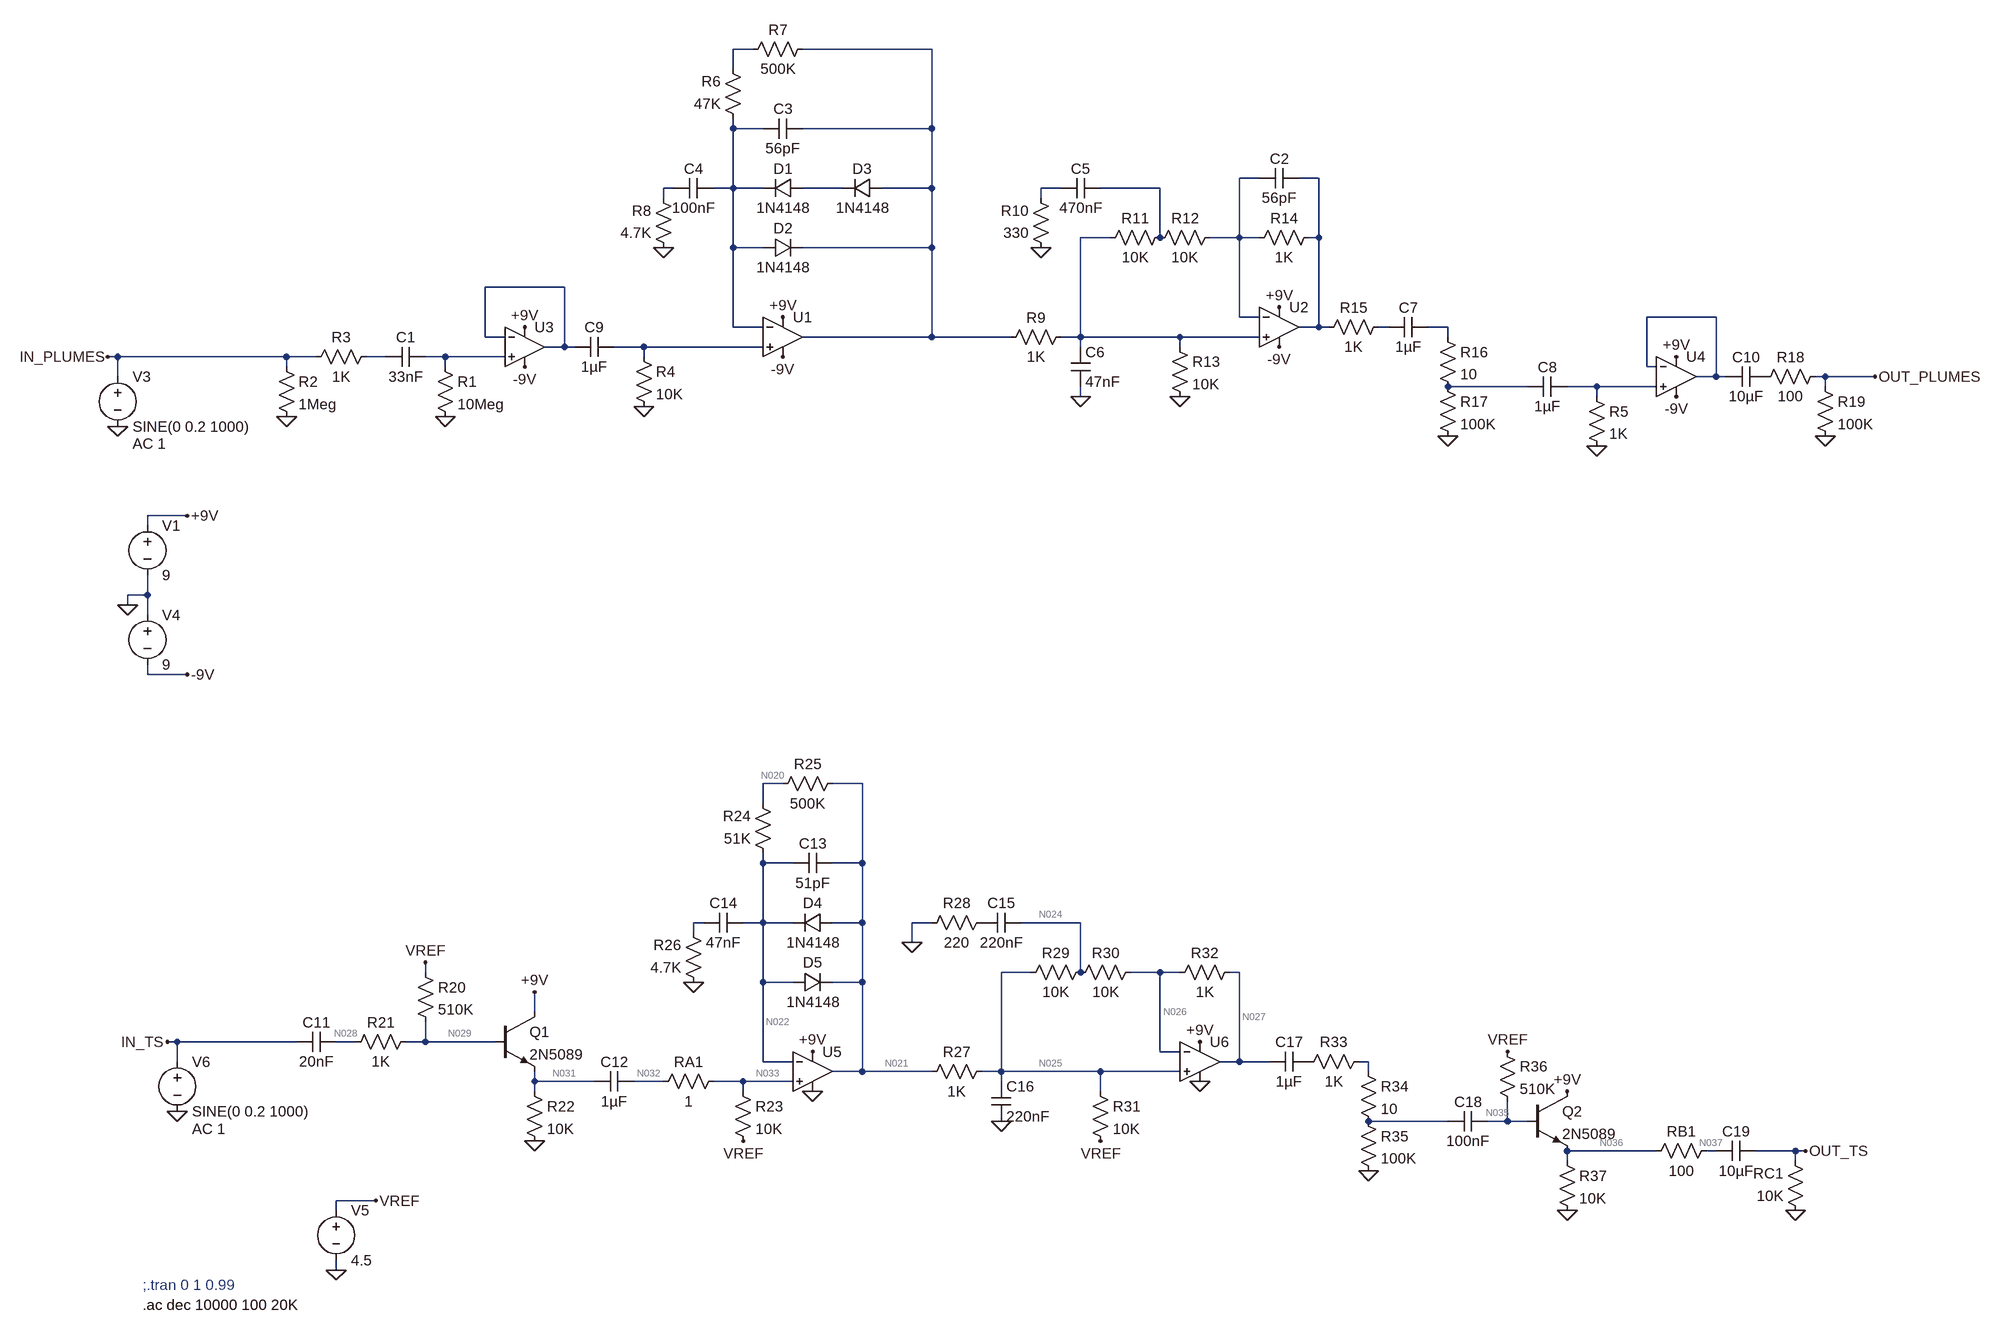
[diagram p0: schematic plumes_TS_sim.asc]
plumes_TS_sim.asc, the LTspice schematic file:
Version 4
SHEET 1 2708 1688
WIRE 608 -352 576 -352
WIRE 896 -352 688 -352
WIRE 576 -320 576 -352
WIRE 576 -224 576 -240
WIRE 624 -224 576 -224
WIRE 896 -224 896 -352
WIRE 896 -224 688 -224
WIRE 1424 -144 1392 -144
WIRE 1520 -144 1488 -144
WIRE 480 -128 464 -128
WIRE 576 -128 576 -224
WIRE 576 -128 544 -128
WIRE 624 -128 576 -128
WIRE 752 -128 688 -128
WIRE 896 -128 896 -224
WIRE 896 -128 816 -128
WIRE 1104 -128 1072 -128
WIRE 1264 -128 1168 -128
WIRE 464 -112 464 -128
WIRE 1072 -112 1072 -128
WIRE 1184 -48 1136 -48
WIRE 1264 -48 1264 -128
WIRE 1392 -48 1392 -144
WIRE 1392 -48 1344 -48
WIRE 1424 -48 1392 -48
WIRE 1520 -48 1520 -144
WIRE 1520 -48 1504 -48
WIRE 576 -32 576 -128
WIRE 624 -32 576 -32
WIRE 896 -32 896 -128
WIRE 896 -32 688 -32
WIRE 304 32 176 32
WIRE 1392 80 1392 -48
WIRE 1424 80 1392 80
WIRE 2160 80 2048 80
WIRE 576 96 576 -32
WIRE 624 96 576 96
WIRE 1520 96 1520 -48
WIRE 1520 96 1488 96
WIRE 1536 96 1520 96
WIRE 1632 96 1616 96
WIRE 1728 96 1696 96
WIRE 176 112 176 32
WIRE 208 112 176 112
WIRE 896 112 896 -32
WIRE 896 112 688 112
WIRE 1024 112 896 112
WIRE 1136 112 1136 -48
WIRE 1136 112 1104 112
WIRE 1296 112 1136 112
WIRE 1424 112 1296 112
WIRE 1728 112 1728 96
WIRE 304 128 304 32
WIRE 304 128 272 128
WIRE 320 128 304 128
WIRE 432 128 384 128
WIRE 624 128 432 128
WIRE 1136 128 1136 112
WIRE 1296 128 1296 112
WIRE -416 144 -432 144
WIRE -144 144 -416 144
WIRE -96 144 -144 144
WIRE 16 144 -16 144
WIRE 112 144 80 144
WIRE 208 144 112 144
WIRE 432 144 432 128
WIRE -144 160 -144 144
WIRE 112 160 112 144
WIRE 2048 160 2048 80
WIRE 2064 160 2048 160
WIRE -416 176 -416 144
WIRE 2160 176 2160 80
WIRE 2160 176 2128 176
WIRE 2176 176 2160 176
WIRE 2336 176 2320 176
WIRE 2416 176 2336 176
WIRE 1856 192 1728 192
WIRE 1968 192 1920 192
WIRE 2064 192 1968 192
WIRE 2336 192 2336 176
WIRE 1136 208 1136 192
WIRE 1968 208 1968 192
WIRE -304 400 -368 400
WIRE -368 416 -368 400
WIRE -368 528 -368 496
WIRE -368 528 -400 528
WIRE -400 544 -400 528
WIRE -368 560 -368 528
WIRE -368 656 -368 640
WIRE -304 656 -368 656
WIRE 656 832 624 832
WIRE 784 832 736 832
WIRE 624 864 624 832
WIRE 624 960 624 944
WIRE 672 960 624 960
WIRE 784 960 784 832
WIRE 784 960 736 960
WIRE 528 1056 512 1056
WIRE 624 1056 624 960
WIRE 624 1056 592 1056
WIRE 672 1056 624 1056
WIRE 784 1056 784 960
WIRE 784 1056 736 1056
WIRE 896 1056 864 1056
WIRE 1136 1056 1040 1056
WIRE 512 1072 512 1056
WIRE 864 1088 864 1056
WIRE 80 1136 80 1120
WIRE 1056 1136 1008 1136
WIRE 1136 1136 1136 1056
WIRE 1264 1136 1216 1136
WIRE 1296 1136 1264 1136
WIRE 1392 1136 1376 1136
WIRE 624 1152 624 1056
WIRE 672 1152 624 1152
WIRE 784 1152 784 1056
WIRE 784 1152 736 1152
WIRE 256 1200 256 1168
WIRE -320 1248 -336 1248
WIRE -128 1248 -320 1248
WIRE -32 1248 -64 1248
WIRE 80 1248 80 1216
WIRE 80 1248 48 1248
WIRE 192 1248 80 1248
WIRE 1264 1264 1264 1136
WIRE 1296 1264 1264 1264
WIRE -320 1280 -320 1248
WIRE 624 1280 624 1152
WIRE 672 1280 624 1280
WIRE 1392 1280 1392 1136
WIRE 1392 1280 1360 1280
WIRE 1440 1280 1392 1280
WIRE 1600 1280 1584 1280
WIRE 784 1296 784 1152
WIRE 784 1296 736 1296
WIRE 896 1296 784 1296
WIRE 1008 1296 1008 1136
WIRE 1008 1296 976 1296
WIRE 1168 1296 1008 1296
WIRE 1296 1296 1168 1296
WIRE 1600 1296 1600 1280
WIRE 256 1312 256 1296
WIRE 352 1312 256 1312
WIRE 464 1312 416 1312
WIRE 592 1312 544 1312
WIRE 672 1312 592 1312
WIRE 1008 1312 1008 1296
WIRE 256 1328 256 1312
WIRE 592 1328 592 1312
WIRE 1168 1328 1168 1296
WIRE 1728 1376 1600 1376
WIRE 1824 1376 1824 1344
WIRE 1824 1376 1792 1376
WIRE 1856 1376 1824 1376
WIRE 2064 1424 1920 1424
WIRE 2160 1424 2144 1424
WIRE 2288 1424 2224 1424
WIRE 2304 1424 2288 1424
WIRE 1920 1440 1920 1424
WIRE 2288 1440 2288 1424
WIRE 0 1504 -64 1504
WIRE -64 1520 -64 1504
WIRE -64 1616 -64 1600
FLAG -304 400 +9V
FLAG -416 256 0
FLAG -432 144 IN_PLUMES
FLAG 464 -32 0
FLAG 656 80 +9V
FLAG 1136 208 0
FLAG 1456 64 +9V
FLAG 1728 272 0
FLAG -144 240 0
FLAG 112 240 0
FLAG 240 96 +9V
FLAG -400 544 0
FLAG -304 656 -9V
FLAG 240 160 -9V
FLAG 432 224 0
FLAG 1296 208 0
FLAG 1968 288 0
FLAG 656 144 -9V
FLAG 1456 128 -9V
FLAG 2096 208 -9V
FLAG 2096 144 +9V
FLAG 2336 272 0
FLAG 2416 176 OUT_PLUMES
FLAG 1072 -32 0
FLAG 256 1408 0
FLAG -64 1616 0
FLAG 0 1504 VREF
FLAG 256 1168 +9V
FLAG 80 1120 VREF
FLAG 592 1408 VREF
FLAG -320 1360 0
FLAG -336 1248 IN_TS
FLAG 512 1152 0
FLAG 704 1264 +9V
FLAG 704 1328 0
FLAG 864 1088 0
FLAG 1008 1376 0
FLAG 1168 1408 VREF
FLAG 1328 1248 +9V
FLAG 1328 1312 0
FLAG 1600 1456 0
FLAG 1824 1264 VREF
FLAG 1920 1520 0
FLAG 1920 1328 +9V
FLAG 2288 1520 0
FLAG 2304 1424 OUT_TS
SYMBOL voltage -368 400 R0
WINDOW 123 0 0 Left 0
WINDOW 39 0 0 Left 0
SYMATTR InstName V1
SYMATTR Value 9
SYMBOL voltage -416 160 R0
WINDOW 123 24 124 Left 2
WINDOW 39 0 0 Left 0
SYMATTR Value2 AC 1
SYMATTR InstName V3
SYMATTR Value SINE(0 0.2 1000)
SYMBOL diode 688 -144 R90
WINDOW 0 0 32 VBottom 2
WINDOW 3 32 32 VTop 2
SYMATTR InstName D1
SYMATTR Value 1N4148
SYMBOL diode 624 -16 R270
WINDOW 0 32 32 VTop 2
WINDOW 3 0 32 VBottom 2
SYMATTR InstName D2
SYMATTR Value 1N4148
SYMBOL cap 688 -240 R90
WINDOW 0 0 32 VBottom 2
WINDOW 3 32 32 VTop 2
SYMATTR InstName C3
SYMATTR Value 56pF
SYMBOL res 592 -224 R180
WINDOW 0 36 76 Left 2
WINDOW 3 36 40 Left 2
SYMATTR InstName R6
SYMATTR Value 47K
SYMBOL res 704 -368 R90
WINDOW 0 0 56 VBottom 2
WINDOW 3 32 56 VTop 2
SYMATTR InstName R7
SYMATTR Value 500K
SYMBOL cap 544 -144 R90
WINDOW 0 0 32 VBottom 2
WINDOW 3 32 32 VTop 2
SYMATTR InstName C4
SYMATTR Value 100nF
SYMBOL res 480 -16 R180
WINDOW 0 36 76 Left 2
WINDOW 3 36 40 Left 2
SYMATTR InstName R8
SYMATTR Value 4.7K
SYMBOL res 1120 96 R90
WINDOW 0 0 56 VBottom 2
WINDOW 3 32 56 VTop 2
SYMATTR InstName R9
SYMATTR Value 1K
SYMBOL cap 1168 -144 R90
WINDOW 0 0 32 VBottom 2
WINDOW 3 32 32 VTop 2
SYMATTR InstName C5
SYMATTR Value 470nF
SYMBOL res 1280 -64 R90
WINDOW 0 0 56 VBottom 2
WINDOW 3 32 56 VTop 2
SYMATTR InstName R11
SYMATTR Value 10K
SYMBOL res 1360 -64 R90
WINDOW 0 0 56 VBottom 2
WINDOW 3 32 56 VTop 2
SYMATTR InstName R12
SYMATTR Value 10K
SYMBOL cap 1120 128 R0
SYMATTR InstName C6
SYMATTR Value 47nF
SYMBOL res 1280 112 R0
SYMATTR InstName R13
SYMATTR Value 10K
SYMBOL res 1520 -64 R90
WINDOW 0 0 56 VBottom 2
WINDOW 3 32 56 VTop 2
SYMATTR InstName R14
SYMATTR Value 1K
SYMBOL res 1632 80 R90
WINDOW 0 0 56 VBottom 2
WINDOW 3 32 56 VTop 2
SYMATTR InstName R15
SYMATTR Value 1K
SYMBOL res 1712 96 R0
SYMATTR InstName R16
SYMATTR Value 10
SYMBOL res 1712 176 R0
SYMATTR InstName R17
SYMATTR Value 100K
SYMBOL cap 1920 176 R90
WINDOW 0 0 32 VBottom 2
WINDOW 3 32 32 VTop 2
SYMATTR InstName C8
SYMATTR Value 1µF
SYMBOL UniversalOpAmp2 656 112 R0
SYMATTR InstName U1
SYMBOL UniversalOpAmp2 1456 96 R0
SYMATTR InstName U2
SYMBOL UniversalOpAmp2 240 128 R0
SYMATTR InstName U3
SYMBOL res 96 144 R0
SYMATTR InstName R1
SYMATTR Value 10Meg
SYMBOL res -160 144 R0
SYMATTR InstName R2
SYMATTR Value 1Meg
SYMBOL res 0 128 R90
WINDOW 0 0 56 VBottom 2
WINDOW 3 32 56 VTop 2
SYMATTR InstName R3
SYMATTR Value 1K
SYMBOL cap 80 128 R90
WINDOW 0 0 32 VBottom 2
WINDOW 3 32 32 VTop 2
SYMATTR InstName C1
SYMATTR Value 33nF
SYMBOL voltage -368 544 R0
WINDOW 123 0 0 Left 0
WINDOW 39 0 0 Left 0
SYMATTR InstName V4
SYMATTR Value 9
SYMBOL cap 384 112 R90
WINDOW 0 0 32 VBottom 2
WINDOW 3 32 32 VTop 2
SYMATTR InstName C9
SYMATTR Value 1µF
SYMBOL res 416 128 R0
SYMATTR InstName R4
SYMATTR Value 10K
SYMBOL cap 1488 -160 R90
WINDOW 0 0 32 VBottom 2
WINDOW 3 32 32 VTop 2
SYMATTR InstName C2
SYMATTR Value 56pF
SYMBOL cap 1696 80 R90
WINDOW 0 0 32 VBottom 2
WINDOW 3 32 32 VTop 2
SYMATTR InstName C7
SYMATTR Value 1µF
SYMBOL res 1952 192 R0
SYMATTR InstName R5
SYMATTR Value 1K
SYMBOL UniversalOpAmp2 2096 176 R0
SYMATTR InstName U4
SYMBOL cap 2240 160 R90
WINDOW 0 0 32 VBottom 2
WINDOW 3 32 32 VTop 2
SYMATTR InstName C10
SYMATTR Value 10µF
SYMBOL res 2336 160 R90
WINDOW 0 0 56 VBottom 2
WINDOW 3 32 56 VTop 2
SYMATTR InstName R18
SYMATTR Value 100
SYMBOL res 2320 176 R0
SYMATTR InstName R19
SYMATTR Value 100K
SYMBOL diode 816 -144 R90
WINDOW 0 0 32 VBottom 2
WINDOW 3 32 32 VTop 2
SYMATTR InstName D3
SYMATTR Value 1N4148
SYMBOL res 1088 -16 R180
WINDOW 0 36 76 Left 2
WINDOW 3 36 40 Left 2
SYMATTR InstName R10
SYMATTR Value 330
SYMBOL npn 192 1200 R0
SYMATTR InstName Q1
SYMATTR Value 2N5089
SYMBOL res 64 1120 R0
SYMATTR InstName R20
SYMATTR Value 510K
SYMBOL res 64 1232 R90
WINDOW 0 0 56 VBottom 2
WINDOW 3 32 56 VTop 2
SYMATTR InstName R21
SYMATTR Value 1K
SYMBOL res 240 1312 R0
SYMATTR InstName R22
SYMATTR Value 10K
SYMBOL res 560 1296 R90
WINDOW 0 0 56 VBottom 2
WINDOW 3 32 56 VTop 2
SYMATTR InstName RA1
SYMATTR Value 1
SYMBOL res 576 1312 R0
SYMATTR InstName R23
SYMATTR Value 10K
SYMBOL cap -64 1232 R90
WINDOW 0 0 32 VBottom 2
WINDOW 3 32 32 VTop 2
SYMATTR InstName C11
SYMATTR Value 20nF
SYMBOL cap 416 1296 R90
WINDOW 0 0 32 VBottom 2
WINDOW 3 32 32 VTop 2
SYMATTR InstName C12
SYMATTR Value 1µF
SYMBOL voltage -64 1504 R0
WINDOW 123 0 0 Left 0
WINDOW 39 0 0 Left 0
SYMATTR InstName V5
SYMATTR Value 4.5
SYMBOL voltage -320 1264 R0
WINDOW 123 24 124 Left 2
WINDOW 39 0 0 Left 0
SYMATTR Value2 AC 1
SYMATTR InstName V6
SYMATTR Value SINE(0 0.2 1000)
SYMBOL diode 736 1040 R90
WINDOW 0 0 32 VBottom 2
WINDOW 3 32 32 VTop 2
SYMATTR InstName D4
SYMATTR Value 1N4148
SYMBOL diode 672 1168 R270
WINDOW 0 32 32 VTop 2
WINDOW 3 0 32 VBottom 2
SYMATTR InstName D5
SYMATTR Value 1N4148
SYMBOL cap 736 944 R90
WINDOW 0 0 32 VBottom 2
WINDOW 3 32 32 VTop 2
SYMATTR InstName C13
SYMATTR Value 51pF
SYMBOL res 640 960 R180
WINDOW 0 36 76 Left 2
WINDOW 3 36 40 Left 2
SYMATTR InstName R24
SYMATTR Value 51K
SYMBOL res 752 816 R90
WINDOW 0 0 56 VBottom 2
WINDOW 3 32 56 VTop 2
SYMATTR InstName R25
SYMATTR Value 500K
SYMBOL cap 592 1040 R90
WINDOW 0 0 32 VBottom 2
WINDOW 3 32 32 VTop 2
SYMATTR InstName C14
SYMATTR Value 47nF
SYMBOL res 528 1168 R180
WINDOW 0 36 76 Left 2
WINDOW 3 36 40 Left 2
SYMATTR InstName R26
SYMATTR Value 4.7K
SYMBOL res 992 1280 R90
WINDOW 0 0 56 VBottom 2
WINDOW 3 32 56 VTop 2
SYMATTR InstName R27
SYMATTR Value 1K
SYMBOL res 992 1040 R90
WINDOW 0 0 56 VBottom 2
WINDOW 3 32 56 VTop 2
SYMATTR InstName R28
SYMATTR Value 220
SYMBOL cap 1040 1040 R90
WINDOW 0 0 32 VBottom 2
WINDOW 3 32 32 VTop 2
SYMATTR InstName C15
SYMATTR Value 220nF
SYMBOL res 1152 1120 R90
WINDOW 0 0 56 VBottom 2
WINDOW 3 32 56 VTop 2
SYMATTR InstName R29
SYMATTR Value 10K
SYMBOL res 1232 1120 R90
WINDOW 0 0 56 VBottom 2
WINDOW 3 32 56 VTop 2
SYMATTR InstName R30
SYMATTR Value 10K
SYMBOL cap 992 1312 R0
SYMATTR InstName C16
SYMATTR Value 220nF
SYMBOL res 1152 1312 R0
SYMATTR InstName R31
SYMATTR Value 10K
SYMBOL res 1392 1120 R90
WINDOW 0 0 56 VBottom 2
WINDOW 3 32 56 VTop 2
SYMATTR InstName R32
SYMATTR Value 1K
SYMBOL cap 1504 1264 R90
WINDOW 0 0 32 VBottom 2
WINDOW 3 32 32 VTop 2
SYMATTR InstName C17
SYMATTR Value 1µF
SYMBOL res 1600 1264 R90
WINDOW 0 0 56 VBottom 2
WINDOW 3 32 56 VTop 2
SYMATTR InstName R33
SYMATTR Value 1K
SYMBOL res 1584 1280 R0
SYMATTR InstName R34
SYMATTR Value 10
SYMBOL res 1584 1360 R0
SYMATTR InstName R35
SYMATTR Value 100K
SYMBOL cap 1792 1360 R90
WINDOW 0 0 32 VBottom 2
WINDOW 3 32 32 VTop 2
SYMATTR InstName C18
SYMATTR Value 100nF
SYMBOL res 1808 1248 R0
SYMATTR InstName R36
SYMATTR Value 510K
SYMBOL res 1904 1424 R0
SYMATTR InstName R37
SYMATTR Value 10K
SYMBOL npn 1856 1328 R0
SYMATTR InstName Q2
SYMATTR Value 2N5089
SYMBOL res 2160 1408 R90
WINDOW 0 0 56 VBottom 2
WINDOW 3 32 56 VTop 2
SYMATTR InstName RB1
SYMATTR Value 100
SYMBOL res 2304 1536 R180
WINDOW 0 36 76 Left 2
WINDOW 3 36 40 Left 2
SYMATTR InstName RC1
SYMATTR Value 10K
SYMBOL cap 2224 1408 R90
WINDOW 0 0 32 VBottom 2
WINDOW 3 32 32 VTop 2
SYMATTR InstName C19
SYMATTR Value 10µF
SYMBOL UniversalOpAmp2 704 1296 R0
SYMATTR InstName U5
SYMBOL UniversalOpAmp2 1328 1280 R0
SYMATTR InstName U6
TEXT -376 1640 Left 2 ;;.tran 0 1 0.99
TEXT -376 1672 Left 2 !.ac dec 10000 100 20K

The netlist it stands for:
* plumes_TS_sim.asc
V1 +9V 0 9
V3 IN_PLUMES 0 SINE(0 0.2 1000) AC 1
D1 N007 N003 1N4148
D2 N003 N002 1N4148
C3 N002 N003 56pF
R6 N003 N001 47K
R7 N002 N001 500K
C4 N003 N006 100nF
R8 0 N006 4.7K
R9 N010 N002 1K
C5 N009 N008 470nF
R11 N009 N010 10K
R12 N004 N009 10K
C6 N010 0 47nF
R13 N010 0 10K
R14 N005 N004 1K
R15 N013 N005 1K
R16 N014 N018 10
R17 N018 0 100K
C8 N019 N018 1µF
XU1 N015 N003 +9V -9V N002 level2 Avol=1Meg GBW=10Meg Slew=10Meg Ilimit=25m Rail=0 Vos=0 En=0 Enk=0 In=0 Ink=0 Rin=500Meg  ; pins In+ In- V+ V- OUT
XU2 N010 N004 +9V -9V N005 level2 Avol=1Meg GBW=10Meg Slew=10Meg Ilimit=25m Rail=0 Vos=0 En=0 Enk=0 In=0 Ink=0 Rin=500Meg  ; pins In+ In- V+ V- OUT
XU3 N017 N011 +9V -9V N011 level2 Avol=1Meg GBW=10Meg Slew=10Meg Ilimit=25m Rail=0 Vos=0 En=0 Enk=0 In=0 Ink=0 Rin=500Meg  ; pins In+ In- V+ V- OUT
R1 N017 0 10Meg
R2 IN_PLUMES 0 1Meg
R3 N016 IN_PLUMES 1K
C1 N017 N016 33nF
V4 0 -9V 9
C9 N015 N011 1µF
R4 N015 0 10K
C2 N005 N004 56pF
C7 N014 N013 1µF
R5 N019 0 1K
XU4 N019 N012 +9V -9V N012 level2 Avol=1Meg GBW=10Meg Slew=10Meg Ilimit=25m Rail=0 Vos=0 En=0 Enk=0 In=0 Ink=0 Rin=500Meg  ; pins In+ In- V+ V- OUT
C10 P001 N012 10µF
R18 OUT_PLUMES P001 100
R19 OUT_PLUMES 0 100K
D3 N002 N007 1N4148
R10 0 N008 330
Q1 +9V N029 N031 0 2N5089
R20 VREF N029 510K
R21 N029 N028 1K
R22 N031 0 10K
RA1 N033 N032 1
R23 N033 VREF 10K
C11 N028 IN_TS 20nF
C12 N032 N031 1µF
V5 VREF 0 4.5
V6 IN_TS 0 SINE(0 0.2 1000) AC 1
D4 N021 N022 1N4148
D5 N022 N021 1N4148
C13 N021 N022 51pF
R24 N022 N020 51K
R25 N021 N020 500K
C14 N022 N023 47nF
R26 0 N023 4.7K
R27 N025 N021 1K
R28 P002 0 220
C15 N024 P002 220nF
R29 N024 N025 10K
R30 N026 N024 10K
C16 N025 0 220nF
R31 N025 VREF 10K
R32 N027 N026 1K
C17 P003 N027 1µF
R33 N030 P003 1K
R34 N030 N034 10
R35 N034 0 100K
C18 N035 N034 100nF
R36 VREF N035 510K
R37 N036 0 10K
Q2 +9V N035 N036 0 2N5089
RB1 N037 N036 100
RC1 0 OUT_TS 10K
C19 OUT_TS N037 10µF
XU5 N033 N022 +9V 0 N021 level2 Avol=1Meg GBW=10Meg Slew=10Meg Ilimit=25m Rail=0 Vos=0 En=0 Enk=0 In=0 Ink=0 Rin=500Meg  ; pins In+ In- V+ V- OUT
XU6 N025 N026 +9V 0 N027 level2 Avol=1Meg GBW=10Meg Slew=10Meg Ilimit=25m Rail=0 Vos=0 En=0 Enk=0 In=0 Ink=0 Rin=500Meg  ; pins In+ In- V+ V- OUT
.model D D
.lib standard.dio
.model NPN NPN
.model PNP PNP
.lib standard.bjt
* ;.tran 0 1 0.99
.ac dec 10000 100 20K
.lib UniversalOpAmp2.lib
.backanno
.end

* Results of the author's LTspice run, read from the files saved beside the schematic
* Operating Point, zero values left out:
*   V(+9v) = 9 V
*   V(-9v) = -9 V
*   V(n029) = 4.264 V
*   V(n031) = 3.623 V
*   V(vref) = 4.5 V
*   V(n028) = 4.264 V
*   V(n033) = 4.5 V
*   V(n032) = 4.5 V
*   V(n021) = 4.5 V
*   V(n022) = 4.5 V
*   V(n020) = 4.5 V
*   V(n025) = 4.5 V
*   V(n024) = 4.5 V
*   V(n026) = 4.5 V
*   V(n027) = 4.5 V
*   V(n035) = 4.264 V
*   V(n036) = 3.623 V
*   V(n037) = 3.623 V
*   Ic(Q1) = 361.9 µA
*   Ib(Q1) = 462 nA
*   Ie(Q1) = -362.4 µA
*   Ic(Q2) = 361.9 µA
*   Ib(Q2) = 462 nA
*   Ie(Q2) = -362.4 µA
*   I(R20) = 462 nA
*   I(R22) = 362.3 µA
*   I(R36) = 462 nA
*   I(R37) = 362.3 µA
*   I(V1) = -5.222 mA
*   I(V4) = -3.599 mA
*   I(V5) = -923.9 nA